# Altium schematic sheet STeaMi-FP4-Alimentation.SchDoc
size A3; DocumentNumber: 1; SheetNumber: 5; SheetTotal: 16
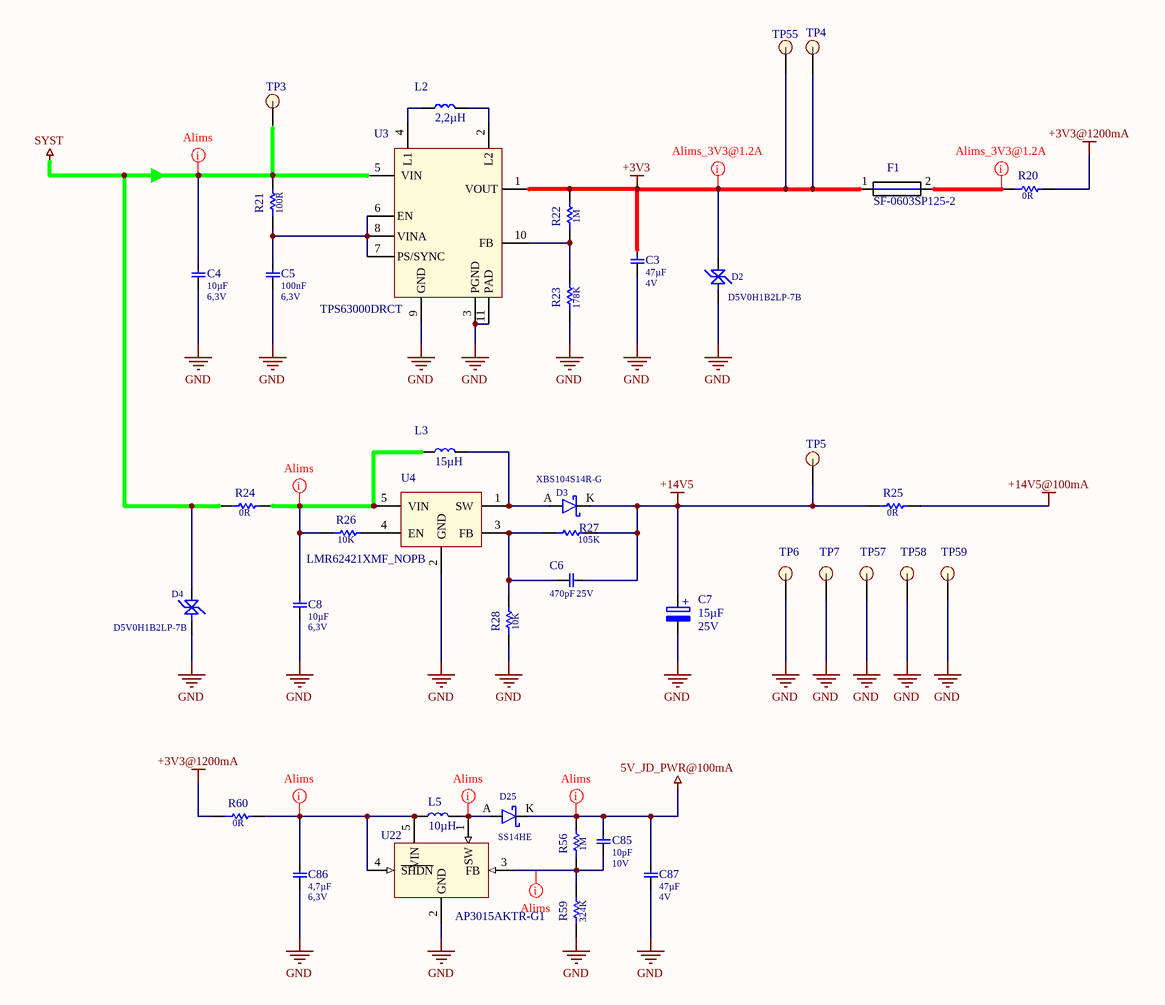
[diagram p0: STeaMi-FP4-Alimentation.SchDoc]

## Parts
C3  Capacitance: 47µF  Voltage: 4V  [0603-CAP]
C4  Capacitance: 10µF  Voltage: 6,3V  [0402-CAP]
C5  Capacitance: 100nF  Voltage: 6,3V  [0402-CAP]
C6  Capacitance: 470pF  Voltage: 25V  [0402-CAP]
C7  Capacitance: 15µF  Voltage: 25V  [CAPC3225X55N_1210 - TANTAL]
C8  Capacitance: 10µF  Voltage: 6,3V  [0402-CAP]
C85  Capacitance: 10pF  Voltage: 10V  [0402-CAP]
C86  Capacitance: 4,7µF  Voltage: 6,3V  [0402-CAP]
C87  Capacitance: 47µF  Voltage: 4V  [0603-CAP]
D2  Part Number: D5V0H1B2LP-7B  [DFN100X60X45-2N]
D3  Part Number: XBS104S14R-G  [SODFL3516X120N]
D4  Part Number: D5V0H1B2LP-7B  [DFN100X60X45-2N]
D25  Part Number: SS14HE  [SOD2314X75N-SOD323HE]
F1  Part Number: SF-0603SP125-2  [FUSM16081X45]
L2  Inductance: 2,2µH  [VLS3012]
L3  Inductance: 15µH  [WE-LQS_4025]
L5  Inductance: 10µH  [VLS3012]
R20  Resistance: 0R  [RESC1005X40N_0402]
R21  Resistance: 100R  [RESC1005X40N_0402]
R22  Resistance: 1M  [RESC1005X40N_0402]
R23  Resistance: 178K  [RESC1005X40N_0402]
R24  Resistance: 0R  [RESC1005X40N_0402]
R25  Resistance: 0R  [RESC1005X40N_0402]
R26  Resistance: 10K  [RESC1005X40N_0402]
R27  Resistance: 105K  [RESC1005X40N_0402]
R28  Resistance: 10K  [RESC1005X40N_0402]
R56  Resistance: 1M  [RESC1005X40N_0402]
R59  Resistance: 324K  [RESC1005X40N_0402]
R60  Resistance: 0R  [RESC1005X40N_0402]
TP3  PAD  [Testpoint 1mm]  (value not drawn)  (no BOM)
TP4  PAD  [Testpoint 1mm]  (value not drawn)  (no BOM)
TP5  PAD  [Testpoint 1mm]  (value not drawn)  (no BOM)
TP6  PAD  [Testpoint 1mm]  (value not drawn)  (no BOM)
TP7  PAD  [Testpoint 1mm]  (value not drawn)  (no BOM)
TP55  PAD  [Testpoint 1mm]  (value not drawn)  (no BOM)
TP57  PAD  [Testpoint 1mm]  (value not drawn)  (no BOM)
TP58  PAD  [Testpoint 1mm]  (value not drawn)  (no BOM)
TP59  PAD  [Testpoint 1mm]  (value not drawn)  (no BOM)
U3  Manufacturer Part Number: TPS63000DRCT  [VSON-10]
U4  (no value)  [SOT95P270X145-5N]
U22  (no value)  [SOT95P280X100-5N SOT23-5]

## Nets
5V_JD_PWR@100mA: C85.2 C87.2 D25.K R56.2
+3V3: C3.2 D2.1(A) F1.1 R22.2 TP4.1 TP55.1 U3.1(VOUT)
+3V3@1200mA: R20.2 R60.1
+14V5: C6.2 C7.1 D3.K R25.1 R27.2 TP5.1
+14V5@100mA: R25.2
GND: C3.1 C4.1 C5.1 C7.2 C8.1 C86.1 C87.1 D2.2(K) D4.2(K) R23.1 R28.1 R59.1 TP6.1 TP7.1 TP57.1 TP58.1 TP59.1 U3.3(PGND) U3.9(GND) U3.11(PAD) U4.2(GND) U22.2(GND)
SYST: C4.2 D4.1(A) R21.2 R24.1 TP3.1 U3.5(VIN)
NetC5_2: C5.2 R21.1 U3.6(EN) U3.7(PS/SYNC) U3.8(VINA)
NetC6_1: C6.1 R27.1 R28.2 U4.3(FB)
NetC8_2: C8.2 L3.1 R24.2 R26.1 U4.5(VIN)
NetC85_1: C85.1 R56.1 R59.2 U22.3(FB)
NetC86_2: C86.2 L5.1 R60.2 U22.4(~{SHDN}) U22.5(VIN)
NetD3_A: D3.A L3.2 U4.1(SW)
NetD25_A: D25.A L5.2 U22.1(SW)
NetF1_2: F1.2 R20.1
NetL2_1: L2.1 U3.4(L1)
NetL2_2: L2.2 U3.2(L2)
NetR22_1: R22.1 R23.2 U3.10(FB)
NetR26_2: R26.2 U4.4(EN)

## Layout directives
net class Alims; rule Width Constraint [Pref Width = 0.4mm    Min Width = 0.3mm    Max Width = 0.5mm]: +3V3, NetF1_2
net class Alims; rule Width Constraint [Pref Width = 0.4mm    Min Width = 0.254mm    Max Width = 0.5mm]: SYST
net class Alims: NetC8_2
net class Alims_JACDAC; rule Width Constraint [Pref Width = 0.4mm    Min Width = 0.254mm    Max Width = 0.5mm]: 5V_JD_PWR@100mA, NetC85_1, NetC86_2, NetD25_A

## Notes on the sheet
- Le présent document est la propriété exclusive de SmartEmbed. Remis à titre confidentiel, il ne peut être communiqué
- IND
- DATE
- DESCRIPTION
- VISA
- à des tiers, ni utilisé ou reproduit qu'en stricte conformité d'autorisations expresses préalables.
- Etabli le:
- Verifié le:
- Validé le:
- Par:
- Page:
- /
- Pépinière CleanTech Domaine du Petit Arbois Avenue Louis Philibert BP 80058 13792 AIX-EN-PROVENCE CEDEX 3
- REFERENCE
- DESIGNATION
- (in symbol 15µF-20%-25V-TANT-1210) +

## Library data of the parts
C3 = 47µF-20%-4V-X5R-0603: CAP CER 47µF 4V X5R 0603; Manufacturer: Taiyo Yuden; Manufacturer Part Number: AMK107BBJ476MA-RE; Populated: True; std Package: 0603; Tolerence: 0,2; Vérification: Non; Created by: EAG; Creation Date: 02/12/2021; Checked by: *; Part Number: 47µF-20%-4V-X5R-0603; Dielectric: X5R; Mouser: 963-AMK107BBJ476MARE; Switch possibility: True; Manufacturer 1: Taiyo Yuden; Manufacturer Part Number 1: AMK107BBJ476MA-RE
C4 C8 = 10µF-20%-6,3V-X5R-0402: CAP CER 10µF 6,3V X5R 0402; Manufacturer: Murata; Manufacturer Part Number: GRM155R60J106ME15D; Populated: True; std Package: 0402; Tolerence: 0,2; Vérification: Non; Created by: EAG; Creation Date: 01/04/2021; Checked by: *; Part Number: 10µF-20%-6,3V-X5R-0402; Dielectric: X5R; Digikey: 490-13238-1-ND; Farnell: -; Mouser: 81-GRM155R60J106ME5D; RS: -; Switch possibility: True
C5 = 100nF-10%-6,3V-X5R-0402: CAP CER 100nF 6,3V X5R 0402; Manufacturer: Kyocera AVX; Manufacturer Part Number: 0402YD104KAT2A; Populated: True; std Package: 0402; Tolerence: 0,1; Vérification: Non; Created by: EAG; Creation Date: 18/10/2021; Checked by: *; Part Number: 100nF-10%-6,3V-X5R-0402; Dielectric: X5R; Digikey: 478-1126-1-ND; Mouser: 581-0402YD104K; Switch possibility: True
C6 = 470pF-10%-25V-X7R-0402: CAP CER 470pF 25V X7R 0402; Manufacturer: Yageo; Manufacturer Part Number: AC0402KRX7R8BB471; Populated: True; Created by: EAG; Creation Date: 22/11/2021; Checked by: *; Part Number: 470pF-10%-25V-X7R-0402
C7 = 15µF-20%-25V-TANT-1210: CAP CER 15µF 25V TANT 1210; Manufacturer: Panasonic; Manufacturer Part Number: 25TQC15MYFB; Populated: True; std Package: 1210; Tolerence: 0,2; Vérification: Non; Created by: EAG; Creation Date: 23/08/2021; Part Number: 15µF-20%-25V-TANT-1210; Dielectric: TANT; Mouser: 667-25TQC15MYFB; Switch possibility: True
C85 = 10pF-5%-10V-COG-0402: CAP CER 10pF 10V COG 0402 5%; Manufacturer: WURTH Electronics; Manufacturer Part Number: 885012005007; Populated: True; std Package: 0402; Tolerence: 0,05; Vérification: Non; Created by: EAG; Creation Date: 01/02/2022; Checked by: *; Part Number: 10pF-5%-10V-COG-0402; Dielectric: COG; Farnell: 2533781; Manufacturer 1: WURTH Electronics; Manufacturer Part Number 1: 885012005007; Mouser: 710-885012005007; Switch possibility: True
C86 = 4,7µF-20%-6,3V-X5R-0402: CAP CER 4,7µF 6,3V X5R 0402; Manufacturer 1: Murata; Manufacturer Part Number 1: GRM155R60J475ME87D; Populated: True; std Package: 0402; Tolerence: 0,2; Vérification: Non; Created by: EAG; Creation Date: 01/04/2021; Manufacturer: ="Manufacturer"; Manufacturer Part Number: ="Manufacturer Part Number"; Checked by: *; Part Number: 4,7µF-20%-6,3V-X5R-0402; Dielectric: X5R; Digikey: 490-5408-6-ND; Manufacturer 2: Samsung Electro-Mechanics; Manufacturer Part Number 2: CL05A475MQ5NRNC; Mouser: 81-GRM155R60J475ME8D; Switch possibility: True
C87 = 47µF-20%-4V-X5R-0603: CAP CER 47µF 4V X5R 0603; Manufacturer 1: Taiyo Yuden; Manufacturer Part Number 1: AMK107BBJ476MA-RE; Populated: True; std Package: 0603; Tolerence: 0,2; Vérification: Non; Created by: EAG; Creation Date: 02/12/2021; Manufacturer: ="Manufacturer"; Manufacturer Part Number: ="Manufacturer Part Number"; Checked by: *; Part Number: 47µF-20%-4V-X5R-0603; Dielectric: X5R; Mouser: 963-AMK107BBJ476MARE; Switch possibility: True
D2 D4 = D5V0H1B2LP-7B: ESD Suppressors / TVS Diodes Transient Voltage Suppressor PP; Manufacturer: Diodes Incorporated; Populated: True; Switch possibility: False; Voltage: 5,5V; Vérification: Non; Created by: EAG; Creation Date: 01/10/2021; Manufacturer Part Number: D5V0H1B2LP-7B; ComponentLink1Description: Datasheet; ComponentLink1URL: https://m.littelfuse.com/~/media/electronics/product_specifications/polymer_esd_suppressors/littelfuse_polymer_esd_suppressor_pesd0402_140_product_specification.pdf.pdf; Digikey: D5V0H1B2LP-7BDICT-ND; Mouser: 621-D5V0H1B2LP-7B
D3 = XBS104S14R-G: Diode Schottky 40 V 1A Montage en surface SOD-123; Manufacturer: Torex Semiconductor; Populated: True; Switch possibility: False; Voltage: 40V; Vérification: Non; Created by: EAG; Creation Date: 18/12/2021; Manufacturer Part Number: XBS104S14R-G; Mouser: 865-XBS104S14R-G
D25 = SS14HE: Diode Schottky 40 V 1A Montage en surface SDO-323HE; Manufacturer: OnSemiconductor; Populated: True; Switch possibility: False; Voltage: 40V; Vérification: Non; Created by: EAG; Creation Date: 01/02/2022; Manufacturer Part Number: SS14HE; Digikey: 512-SS14HE; Farnell: 2929794
F1 = SF-0603SP125-2: Fusible 50V 1,25 A Slow blow; Populated: True; Created by: *; Creation Date: *; Manufacturer: ="Manufacturer"; Manufacturer Part Number: ="Manufacturer Part Number"; Checked by: *; ComponentLink1Description: Datasheet; ComponentLink1URL: https://us.schurter.com/en/datasheet/typ_UMT_250.pdf
L2 = 2,2µH-20%-1,89A-74 mOhms: Fixed Inductor 10µH ± 20% 1,4A 3x3x1,2mm; Manufacturer: TDK; Manufacturer Part Number: VLS3012CX-2R2M-1; Populated: True; DC Current: 1,89A; Switch possibility: False; Tolerence: 0,2; Vérification: Non; Created by: EAG; Creation Date: 17/12/2021; Part Number: 2,2µH-20%-1,89A-74 mOhms; Mouser: 810-VLS3012CX-2R2M-1; Resistance: 74 mOhms
L3 = 15µH-20%-0,84-132 mOhms%: Fixed Inductor 10µH ± 20% 1,4A 5,8mm; Manufacturer: Wurth; Manufacturer Part Number: 74404043150A; Populated: True; DC Current: 0,84; Switch possibility: False; Tolerence: 0,2; Vérification: Non; Created by: EAG; Creation Date: 22/11/2021; Part Number: 15µH-20%-0,84-132 mOhms%; Digikey: 732-10760-1-ND; Mouser: 710-74404043150A; Resistance: 132 mOhms%
L5 = 10µH-20%-1,12A-324mOhms: Fixed Inductor 10µH ± 20% 1,12A 3x3x1,2mm; Manufacturer: TDK; Manufacturer Part Number: VLS3012CX-100M-1; Populated: True; DC Current: 1,12A; Switch possibility: False; Tolerence: 0,2; Vérification: Non; Created by: EAG; Creation Date: 25/01/2022; Part Number: 10µH-20%-1,12A-324mOhms; Farnell: 3212546; Mouser: 810-VLS3012CX-100M-1; Resistance: 324mOhms
R20 R24 R25 R60 = 0R-5%-0,0625W-0402: RES CMS 0R5%-0,0625W-0402; Manufacturer: Yageo; Manufacturer Part Number: RC0402JR-100RL; Populated: True; Power: 0,0625; Nom vérificateur: Non; Prix: 0,09; std Package: 0402; Tolerence: 0,05; Created by: EAG; Creation Date: 02/12/2021; Part Number: 0R-5%-0,0625W-0402; Mouser: 603-RC0402JR-100RL; Switch possibility: True
R21 = 100R-5%-0,0625W-0402: RES CMS 100R5%-0,0625W-0402 ±100ppm/°C; Manufacturer: Yageo; Manufacturer Part Number: RC0402JR-07100RL; Populated: True; Power: 0,0625; Nom vérificateur: Non; Prix: 0,09; std Package: 0402; Tolerence: 0,05; Created by: EAG; Creation Date: 02/12/2021; Part Number: 100R-5%-0,0625W-0402; Digikey: 311-100JRCT-ND; Farnell: 9232648; Switch possibility: True
R22 R56 = 1M-1%-0,125W-0402: RES CMS 1M1%-0,125W-0402 ±0ppm/°C; Manufacturer: Yageo; Manufacturer Part Number: RC0402FR-7W1ML; Populated: True; Power: 0,125; Nom vérificateur: Non; Prix: 0,09; std Package: 0402; Tolerence: 0,01; Created by: EAG; Creation Date: 22/11/2021; Part Number: 1M-1%-0,125W-0402; Mouser: 603-RC0402FR-7W1ML; Switch possibility: True
R23 = 178K-1%-0,1W-0402: RES CMS 178K1%-0,1W-0402 ±25ppm/°C; Manufacturer: Panasonic; Manufacturer Part Number: ERJ-2RKF1783X; Populated: True; Power: 0,1; Nom vérificateur: Non; Prix: 0,085; std Package: 0402; Tolerence: 0,01; Created by: EAG; Creation Date: 01/04/2021; Part Number: 178K-1%-0,1W-0402; Mouser: 667-ERJ-2RKF1783X; Switch possibility: True
R26 R28 = 10K-1%-0,0625W-0402: RES CMS 10K1%-0,0625W-0402 ±100ppm/°C; Manufacturer: Yageo; Manufacturer Part Number: AC0402FR-1310KL; Populated: True; Power: 0,0625; Nom vérificateur: Non; Prix: 0,088; std Package: 0402; Tolerence: 0,01; Created by: EAG; Creation Date: 08/06/2021; Part Number: 10K-1%-0,0625W-0402; Mouser: 603-AC0402FR-1310KL; Switch possibility: True
R27 = 105K-0,5%-0,1W-0402: RES CMS 105K0,5%-0,1W-0402 ±0ppm/°C; Manufacturer: Panasonic; Manufacturer Part Number: ERJ-2RKF1053X; Populated: True; Power: 0,1; Nom vérificateur: Non; Prix: 0,08; std Package: 0402; Tolerence: 0,005; Created by: EAG; Creation Date: 22/11/2021; Part Number: 105K-0,5%-0,1W-0402; Farnell: 2302841; Mouser: 667-ERJ-2RKF1053X; Switch possibility: True
R59 = 324K-1%-0,0625W-0402: RES CMS 324K1%-0,0625W-0402 ±100ppm/°C; Manufacturer: Yageo; Manufacturer Part Number: AC0402FR-07324KL; Populated: True; Power: 0,0625; Liste: Non; Prix: 0,088; std Package: 0402; Tolerence: 0,01; Created by: EAG; Creation Date: 01/02/2022; Part Number: 324K-1%-0,0625W-0402; Digikey: 13-AC0402FR-07324KLCT-ND; Mouser: 603-AC0402FR-07324KL; Nom vérificateur: Non; Switch possibility: True
TP3-TP7 TP55 TP57-TP59 = TESTPOINTPAD: Manufacturer: Smartembed; Switch possibility: False; Vérification: Non; Package: PAD_TEST; Part Number: TESTPOINTPAD; Created by: EAG; Creation Date: 11/03/2020; Digikey: -; Farnell: -; Manufacturer Part Number: TESTPOINT; Mouser: -; RS: -
U3 = TPS63000: High Efficient single inductor buck-boost converter with 1,8-A switches ajustable; Manufacturer: Texas Instruments; Populated: False; Switch possibility: False; Vérification: Non; Created by: EAG; Creation Date: 30/09/2019; Checked by: *; ComponentLink1Description: Datasheet; ComponentLink1URL: http://www.ti.com/lit/ds/symlink/tps63000.pdf; Part Number: TPS63000; Mouser: 595-TPS63000DRCR
U4 = LMR62421XMF_NOPB: Simple Switcher 24Vout 2,1A Step-Up SOT-23; Manufacturer: Texas Instruments; Populated: False; Switch possibility: False; Vérification: Non; Created by: EAG; Creation Date: 23/08/2021; Checked by: *; Ambient Temperature: ='Ambient temp'; Storage temperature: ='Storage temp'; Current: *; RoHs compliant: ='Rohs'; Datasheet: ='Datasheet'; Manufacturer Part Number: LMR62421XMF_NOPB; Part Number: LMR62421XMF_NOPB; Mouser: 926-LMR62421XMF/NOPB
U22 = AP3015AKTR-G1: Survolteur Régulateur à découpage IC Positif Réglable 1,23V 1 Sortie 75mA (Commutateur) SC-74A, SOT-753; Manufacturer: Diodes Incorporated; Populated: False; RS: 8287438; Switch possibility: False; Vérification: Non; Created by: EAG; Creation Date: 25/01/2022; Checked by: *; Ambient Temperature: ='Ambient temp'; Storage temperature: ='Storage temp'; Current: *; RoHs compliant: ='Rohs'; Datasheet: ='Datasheet'; Manufacturer Part Number: AP3015AKTR-G1; Part Number: AP3015AKTR-G1; Digikey: AP3015AKTR-G1DICT-ND